# EAGLE design spinduino (EAGLE 8.2.2)
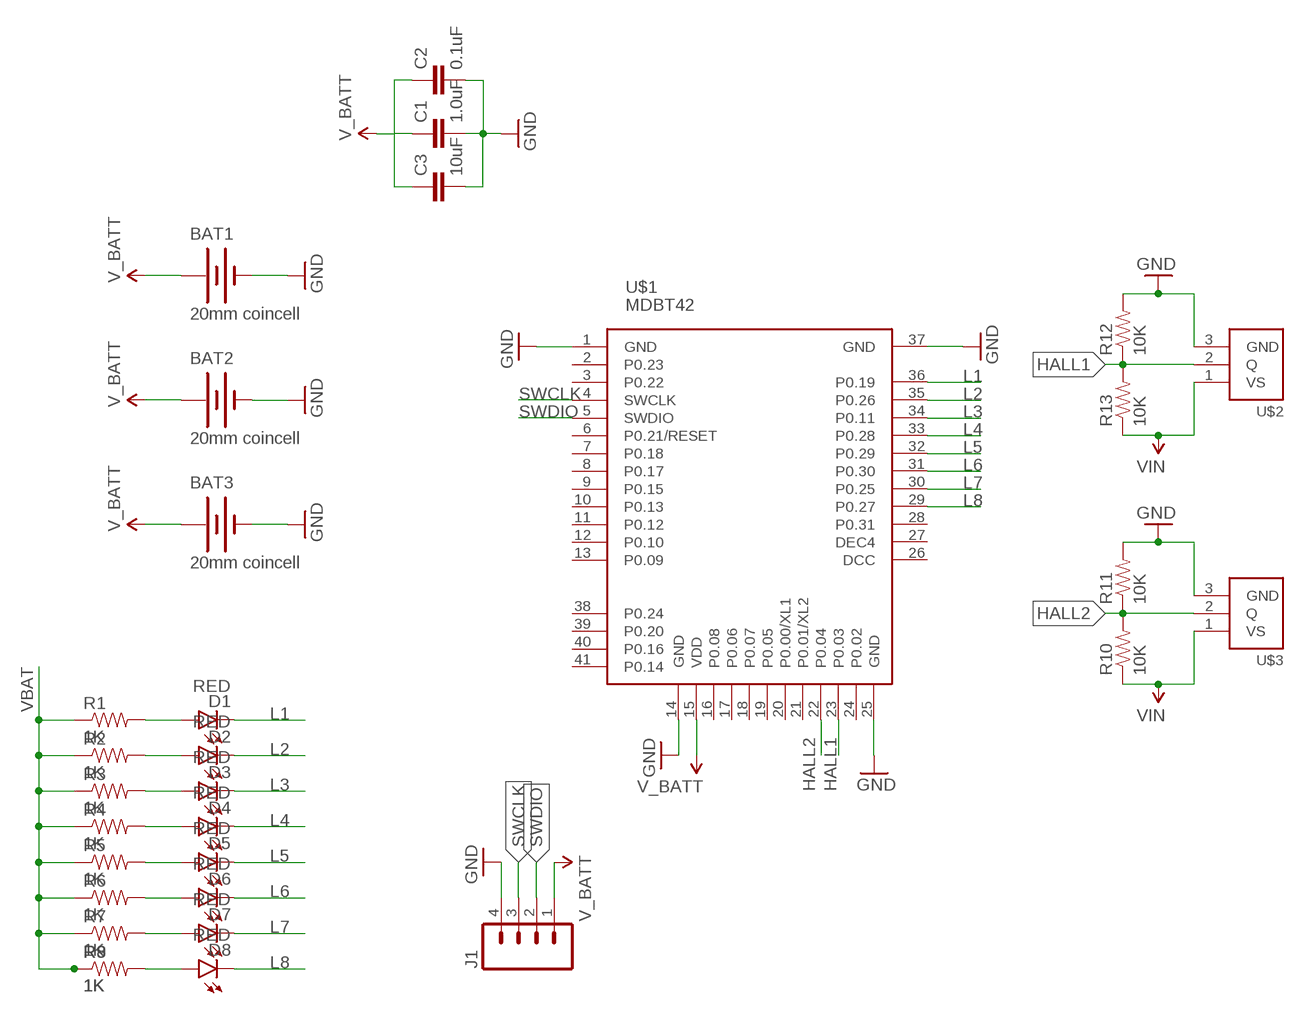
[diagram p0: schematic, sheet 1]

## Parts
BAT1  20mm coincell  BATTERY20MM_4LEGS  [BATTCON_20MM_4LEGS]
BAT2  20mm coincell  BATTERY20MM_4LEGS  [BATTCON_20MM_4LEGS]
BAT3  20mm coincell  BATTERY20MM_4LEGS  [BATTCON_20MM_4LEGS]
C1  1.0uF  1.0UF-16V-10%(0603)  [0603-CAP]
C2  0.1uF  0.1UF-25V-5%(0603)  [0603-CAP]
C3  10uF  10UF-6.3V-20%(0603)  [0603-CAP]
D1  RED  LED-RED0603  [LED-0603]
D2  RED  LED-RED0603  [LED-0603]
D3  RED  LED-RED0603  [LED-0603]
D4  RED  LED-RED0603  [LED-0603]
D5  RED  LED-RED0603  [LED-0603]
D6  RED  LED-RED0603  [LED-0603]
D7  RED  LED-RED0603  [LED-0603]
D8  RED  LED-RED0603  [LED-0603]
J1  M04LOCK  [1X04_LOCK]
R1  1K  1KOHM-1/10W-1%(0603)  [0603-RES]
R2  1K  1KOHM-1/10W-1%(0603)  [0603-RES]
R3  1K  1KOHM-1/10W-1%(0603)  [0603-RES]
R4  1K  1KOHM-1/10W-1%(0603)  [0603-RES]
R5  1K  1KOHM-1/10W-1%(0603)  [0603-RES]
R6  1K  1KOHM-1/10W-1%(0603)  [0603-RES]
R7  1K  1KOHM-1/10W-1%(0603)  [0603-RES]
R8  1K  1KOHM-1/10W-1%(0603)  [0603-RES]
R9  1K  1KOHM-1/10W-1%(0603)  [0603-RES]
R10  10K  10KOHM-1/10W-1%(0603)0603  [0603-RES]
R11  10K  10KOHM-1/10W-1%(0603)0603  [0603-RES]
R12  10K  10KOHM-1/10W-1%(0603)0603  [0603-RES]
R13  10K  10KOHM-1/10W-1%(0603)0603  [0603-RES]
U$1  MDBT42  [MDBT42]
U$2  TLE4946-2KSMD  [SC-59]
U$3  TLE4946-2KSMD  [SC-59]

## Nets
GND: BAT1.NEGATIVE(-) BAT2.NEGATIVE(-) BAT3.NEGATIVE(-) C1.2 C2.2 C3.2 J1.4 R11.2 R12.2 U$1.1(GND) U$1.14(GND) U$1.25(GND) U$1.37(GND) U$2.3(GND) U$3.3(GND)
HALL1: R12.1 R13.2 U$1.23(P0.03) U$2.2(Q)
HALL2: R10.2 R11.1 U$1.22(P0.04) U$3.2(Q)
L1: D1.C U$1.36(P0.19)
L2: D2.C U$1.35(P0.26)
L3: D3.C U$1.34(P0.11)
L4: D4.C U$1.33(P0.28)
L5: D5.C U$1.32(P0.29)
L6: D6.C U$1.31(P0.30)
L7: D7.C U$1.30(P0.25)
L8: D8.C U$1.29(P0.27)
N$1: D8.A R8.2 R9.2
N$3: D1.A R1.2
N$4: D2.A R2.2
N$5: D3.A R3.2
N$6: D4.A R4.2
N$7: D5.A R5.2
N$8: D6.A R6.2
N$9: D7.A R7.2
SWCLK: J1.3 U$1.4(SWCLK)
SWDIO: J1.2 U$1.5(SWDIO)
V_BATT: BAT1.POSITIVE@1(+) BAT1.POSITIVE@2(+) BAT1.POSITIVE@3(+) BAT1.POSITIVE@4(+) BAT2.POSITIVE@1(+) BAT2.POSITIVE@2(+) BAT2.POSITIVE@3(+) BAT2.POSITIVE@4(+) BAT3.POSITIVE@1(+) BAT3.POSITIVE@2(+) BAT3.POSITIVE@3(+) BAT3.POSITIVE@4(+) C1.1 C2.1 C3.1 J1.1 U$1.15(VDD)
VBAT: R1.1 R2.1 R3.1 R4.1 R5.1 R6.1 R7.1 R8.1 R9.1 R10.1 R13.1 U$2.1(VS) U$3.1(VS) ; supply symbol labelled VIN
Unconnected: U$1.2(P0.23) U$1.3(P0.22) U$1.6(P0.21/RESET) U$1.7(P0.18) U$1.8(P0.17) U$1.9(P0.15) U$1.10(P0.13) U$1.11(P0.12) U$1.12(P0.10) U$1.13(P0.09) U$1.16(P0.08) U$1.17(P0.06) U$1.18(P0.07) U$1.19(P0.05) U$1.20(P0.00/XL1) U$1.21(P0.01/XL2) U$1.24(P0.02) U$1.26(DCC) U$1.27(DEC4) U$1.28(P0.31) U$1.38(P0.24) U$1.39(P0.20) U$1.40(P0.16) U$1.41(P0.14)

## Library data of the parts
BAT1-BAT3 = ng-beacon:BATTERY: Battery Holders Various common sizes : AA, AAA, 18650 (PRT-12895), 20mm coin cell and 12mm coin cell. 20MM_4LEGS, BATT-10373; PROD_ID: BATT-10373
C1 = SparkFun-Capacitors:1.0UF-16V-10%(0603): CAP-00868; PROD_ID: CAP-00868
C2 = SparkFun-Capacitors:0.1UF-25V-5%(0603): CAP-08604; PROD_ID: CAP-08604
C3 = SparkFun-Capacitors:10UF-6.3V-20%(0603): CAP-11015; PROD_ID: CAP-11015
D1-D8 = SparkFun-LED:LED-RED: Assorted Red LEDs LilyPad 1206- DIO-09912 1206- DIO-00809 0603- DIO-00819 "SMART" means more efficient and expensive; PROD_ID: DIO-00819
J1 = ng-beacon:M04: Header 4 Standard 4-pin 0.1" header. Use with straight break away headers (SKU : PRT-00116), right angle break away headers (PRT-00553), swiss pins (PRT-00743), machine pins (PRT-00117), and female headers (PRT-00115). Molex polarized connector foot print use with SKU : PRT-08231 with associated crimp pins and housings. 1MM SMD Version SKU: PRT-10208; PROD_ID: CONN-09696
R1-R9 = SparkFun-Resistors:1KOHM-1/10W-1%(0603): RES-07856; PROD_ID: RES-07856
R10-R13 = SparkFun-Resistors:10KOHM-1/10W-1%(0603): RES-00824; PROD_ID: RES-00824
U$1 = MDBT42:MDBT42: Raytac Corporation MDBT42-512K, MDBT42-P512K Bluetooth Low Energy Module based on Noridc nRF52832 Source: Raytac datasheet
U$2 U$3 = uri:TLE4946-2K: TLE4946-2K High Precision Hall Effect Latch Datasheet <https://www.infineon.com/dgdl/Infineon-TLE4946_2K-DS-v01_00-en.pdf?fileId=db3a30431f848401011fbc925c48637f>

## Board
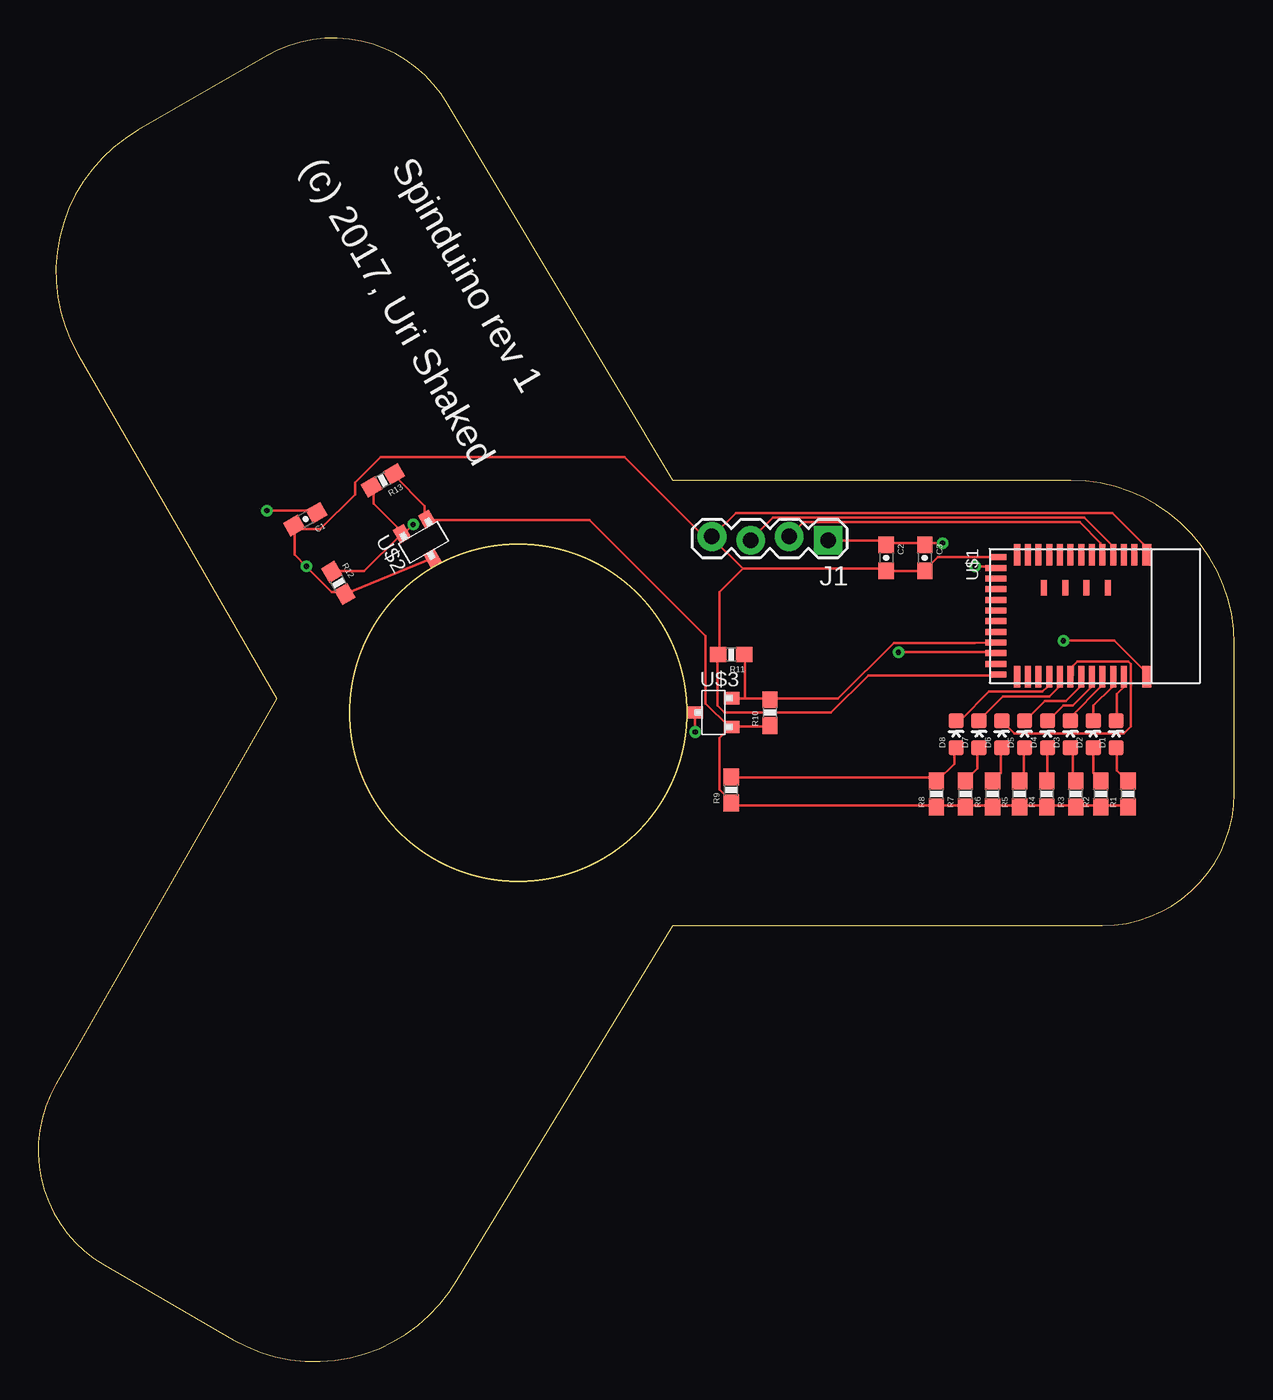
[diagram p1: board, top side]
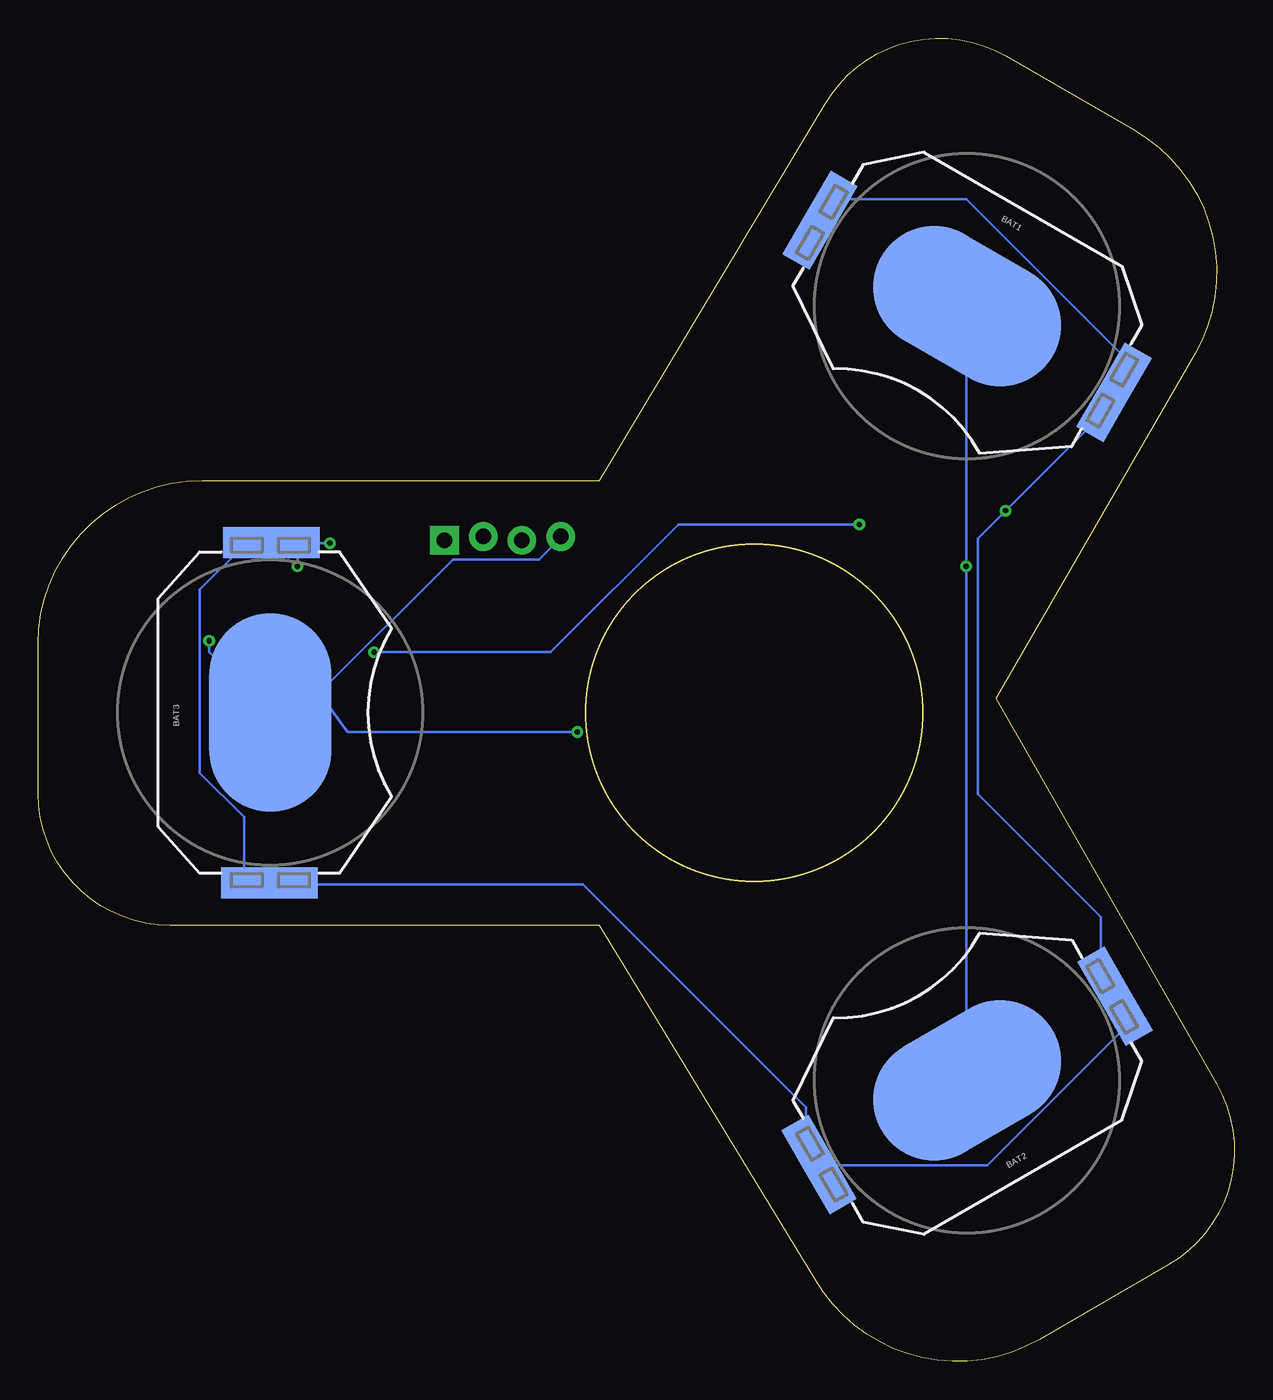
[diagram p2: board, bottom side, seen from below]

Size 78.51 x 86.84 mm. Coordinates in mm from the lower left corner, seen from the top.
Outline: 41.68,28.6 69.84,28.6 arc90 78.51,37.28 78.51,47.06 arc90 67.76,57.81 41.68,57.81 26.86,82.51 arc90 15.01,85.68 6.54,80.79 arc90 2.6,66.1 15.64,43.52 1.16,18.18 arc90 4.33,6.33 12.81,1.44 arc90 27.49,5.37 41.68,28.6
Outline: circle at 31.52,42.57 radius 11.05
Copper layers (1*16): Top 0.035mm / dielectric 1.5mm / Bottom 0.035mm
Design rules "default": minimum track width 6mil, minimum drill 0.35mm, track to track 6mil, track to pad 6mil, pad to pad 6mil, via to via 6mil, smd to smd 6mil, copper to edge 40mil, drill to drill 6mil, minimum pad ring 10mil, minimum via ring 8mil, stop-mask expansion 4mil, vias tented up to drill 0mil, thermal gap 10mil

### Footprints (pad centres in the part's own frame; a part is rotated, then mirrored left to right if it is on the bottom)
BATTCON_20MM_4LEGS = smd 13 x 8: NEGATIVE 0,0 | smd 2.032 x 3.175: POSITIVE@1 -11.176,1.651; POSITIVE@2 -11.176,-1.524; POSITIVE@3 11.176,1.524; POSITIVE@4 11.176,-1.651
0603-CAP = smd 1.1 x 1: 1 -0.85,0; 2 0.85,0
LED-0603 = smd 1 x 1: A 0,-0.877; C 0,0.877
1X04_LOCK = drill 1.016 pad 1.88 square: 1 0,0.127 | drill 1.016 pad 1.88: 2 2.54,-0.127; 3 5.08,0.127; 4 7.62,-0.127
0603-RES = smd 1.1 x 1: 1 -0.85,0; 2 0.85,0
MDBT42 = smd 1.4 x 0.6: 1 -4,4.4; 37 4,4.4 | smd 1.4 x 0.4: 2 -4,3.6; 3 -4,2.9; 4 -4,2.2; 5 -4,1.5; 6 -4,0.8; 7 -4,0.1; 8 -4,-0.6; 9 -4,-1.3; 10 -4,-2; 11 -4,-2.7; 12 -4,-3.4; 13 -4,-4.1; 26 4,-4.1; 27 4,-3.4; 28 4,-2.7; 29 4,-2; 30 4,-1.3; 31 4,-0.6; 32 4,0.1; 33 4,0.8; 34 4,1.5; 35 4,2.2; 36 4,2.9 | smd 0.4 x 1.1: 14 -3.85,-5.35; 25 3.85,-5.35 | smd 0.4 x 1.4: 15 -3.15,-5.5; 16 -2.45,-5.5; 17 -1.75,-5.5; 18 -1.05,-5.5; 19 -0.35,-5.5; 20 0.35,-5.5; 21 1.05,-5.5; 22 1.75,-5.5; 23 2.45,-5.5; 24 3.15,-5.5 | smd 1 x 0.4: 38 -1.85,1.85; 39 -1.85,0.45; 40 -1.85,-0.95; 41 -1.85,-2.35
SC-59 = smd 0.8 x 1: 1 -0.95,-1.2; 2 0.95,-1.2; 3 0,1.2

### Placement (x,y rotation side)
BAT1  17.55,69.24 330 bottom
BAT2  17.55,18.44 210 bottom
BAT3  63.27,42.57 90 bottom
C1  17.55,55.27 210 top
C2  55.65,52.73 270 top
C3  58.19,52.73 270 top
D1  70.74,41.16 0 top
D2  69.24,41.16 0 top
D3  67.74,41.16 0 top
D4  66.24,41.16 0 top
D5  64.74,41.16 0 top
D6  63.24,41.16 0 top
D7  61.74,41.16 0 top
D8  60.24,41.16 0 top
J1  51.84,54 180 top
R1  71.52,37.24 90 top
R2  69.75,37.24 90 top
R3  68.09,37.24 90 top
R4  66.19,37.24 90 top
R5  64.41,37.24 90 top
R6  62.63,37.24 90 top
R7  60.86,37.24 90 top
R8  58.95,37.24 90 top
R9  45.49,37.49 90 top
R10  48.03,42.57 90 top
R11  45.49,46.38 180 top
R12  19.71,51.08 300 top
R13  22.63,57.81 210 top
U$1  68.35,48.92 270 top
U$2  25.3,53.75 210 top
U$3  44.32,42.57 90 top

### Tracks (layer width: path | path; a pad name or v marks a point on that pad's centre or on a via)
GND  (via drill 0.35)
  Top 0.152: U$2.3 R12.2 20.04,50.5 19.28,50.5 v17.6,52.17 16.84,52.94 16.84,54.61 | v67.28,47.3 70.63,47.3 72.62,45.32 72.62,45.01 U$1.37 | U$1.25 62.86,45.01 54.48,45.01 52.04,42.57 45.03,42.57 44.57,43.03 44.57,46.38 R11.2 44.73,46.38 44.73,50.5 46.25,52.02 | 16.84,54.61 16.84,54.77 C1.2 16.84,54.61 | U$1.14 62.86,52.78 59.05,52.78 58.29,52.02 C3.2 58.14,51.87 55.7,51.87 C2.2 55.55,52.02 46.25,52.02 | U$1.1 72.62,52.94 72.62,53.55 70.48,55.68 45.79,55.68 44.27,54.16 J1.4 | 46.25,52.02 44.27,54 J1.4 | 16.84,54.61 18.51,54.61 20.8,56.9 20.8,57.66 22.48,59.34 38.48,59.34 43.66,54.16 44.12,54.16 J1.4 | U$3.3 v43.12,41.3
  Bottom 0.152: v67.28,47.3 67.28,46.54 63.32,42.57 BAT3.NEGATIVE 61.34,42.57 60.06,43.85 | 60.06,43.85 51.28,52.63 45.64,52.63 44.27,54 J1.4 | BAT2.NEGATIVE 17.6,18.49 v17.6,52.17 17.6,69.24 BAT1.NEGATIVE | v43.12,41.3 58.19,41.3 60.06,43.85
HALL1  (via drill 0.35)
  Top 0.152: R12.1 19.43,51.87 21.41,51.87 23.85,54.31 U$2.2 | R13.2 22.02,57.36 22.02,56.29 23.85,54.46 U$2.2 | v56.46,46.54 62.71,46.54 U$1.23 | v24.61,54.92 24,54.31 U$2.2
  Bottom 0.152: v56.46,46.54 44.88,46.54 36.5,54.92 v24.61,54.92
HALL2
  Top 0.152: 46.4,43.49 47.93,43.49 R10.2 48.08,43.49 52.5,43.49 56.16,47.15 61.49,47.15 U$1.22 | 46.4,43.49 45.49,43.49 U$3.2 | 46.4,43.49 46.4,46.38 R11.1
L1
  Top 0.152: D1.C 70.79,42.12 70.79,43.79 71.24,44.25 71.24,44.86 U$1.36
L2
  Top 0.152: D2.C 69.26,42.12 69.26,43.03 70.48,44.25 70.48,44.86 U$1.35
L3
  Top 0.152: D3.C 67.89,42.12 67.89,42.42 69.72,44.25 69.72,44.86 U$1.34
L4
  Top 0.152: D4.C 66.37,42.12 67.28,43.03 67.89,43.03 69.11,44.25 69.11,44.86 U$1.33
L5
  Top 0.152: D5.C 64.84,42.12 66.06,43.34 67.43,43.34 68.35,44.25 68.35,44.86 U$1.32
L6
  Top 0.152: D6.C 63.32,41.96 64.08,41.2 71.24,41.2 71.7,41.66 71.7,45.77 71.55,45.93 68.2,45.93 67.89,45.62 67.89,45.01 U$1.31
L7
  Top 0.152: D7.C 61.8,42.12 63.32,43.64 66.37,43.64 66.98,44.25 66.98,44.86 U$1.30
L8
  Top 0.152: D8.C 60.27,42.12 60.58,42.12 62.4,43.95 65.91,43.95 66.21,44.25 66.21,44.86 U$1.29
N$1
  Top 0.152: R9.2 45.49,38.31 58.75,38.31 58.9,38.15 R8.2 59.05,38.15 60.12,39.22 60.12,40.14 D8.A
N$3
  Top 0.152: D1.A 70.79,40.14 70.79,38.76 71.4,38.15 R1.2
N$4
  Top 0.152: D2.A 69.26,40.14 69.26,38.61 69.72,38.15 R2.2
N$5
  Top 0.152: D3.A 67.89,40.14 67.89,38.31 68.04,38.15 R3.2
N$6
  Top 0.152: D4.A 66.21,40.14 66.21,38.15 R4.2
N$7
  Top 0.152: D5.A 64.69,40.14 64.69,38.31 64.54,38.15 R5.2
N$8
  Top 0.152: D6.A 63.17,40.14 63.17,38.61 62.71,38.15 R6.2
N$9
  Top 0.152: D7.A 61.64,40.14 61.64,38.92 60.88,38.15 R7.2
SWCLK
  Top 0.152: U$1.4 70.48,52.94 70.48,53.55 68.65,55.38 48.23,55.38 46.86,54 J1.3
SWDIO
  Top 0.152: U$1.5 69.72,52.94 69.72,53.7 68.35,55.07 50.21,55.07 49.3,54.16 J1.2
V_BATT  (via drill 0.35)
  Top 0.152: v61.49,52.17 62.71,52.17 U$1.15 | v59.36,53.7 58.29,53.7 C3.1 58.14,53.7 55.7,53.7 C2.1 | 55.39,53.85 55.55,53.7 C2.1 | v15.01,55.83 18.21,55.83 C1.1 | 55.39,53.85 51.89,53.85 J1.1 | 55.39,53.85 C2.1
  Bottom 0.152: 26.59,12.86 26.59,11.64 BAT2.POSITIVE@3 26.59,12.86 | 26.59,12.86 27.96,14.23 BAT2.POSITIVE@4 28.11,14.38 28.11,16.67 42.75,31.3 61.64,31.3 BAT3.POSITIVE@2 BAT3.POSITIVE@1 65,31.45 65,35.72 67.89,38.61 67.89,50.65 BAT3.POSITIVE@3 64.69,53.85 61.64,53.85 BAT3.POSITIVE@4 61.49,53.7 | 26.59,12.86 16.23,12.86 7.08,22 7.08,22.46 BAT2.POSITIVE@1 7.08,22.61 7.08,23.68 8.61,25.2 BAT2.POSITIVE@2 8.76,25.35 8.76,29.16 16.84,37.24 16.84,54 v15.01,55.83 8.76,62.08 BAT1.POSITIVE@4 8.61,62.23 7.24,63.6 7.24,64.82 BAT1.POSITIVE@3 7.24,64.98 7.24,65.89 17.6,76.25 26.29,76.25 BAT1.POSITIVE@1 26.44,76.25 27.96,74.73 27.96,73.66 BAT1.POSITIVE@2 | 61.49,53.7 v61.49,52.17 | v59.36,53.7 61.49,53.7
VBAT
  Top 0.152: R1.1 71.4,36.48 69.87,36.48 R2.1 69.72,36.48 68.2,36.48 R3.1 68.04,36.48 66.21,36.48 R4.1 66.06,36.48 64.54,36.48 R5.1 64.39,36.48 62.71,36.48 R6.1 62.56,36.48 60.88,36.48 R7.1 60.73,36.48 59.05,36.48 R8.1 58.9,36.48 45.64,36.48 45.49,36.63 R9.1 45.49,36.78 44.73,37.54 44.73,40.9 45.34,41.51 U$3.1 | R13.1 23.39,58.12 25.37,56.14 25.37,55.38 U$2.1 25.52,55.22 36.19,55.22 43.81,47.6 43.81,43.18 45.34,41.66 U$3.1 | U$3.1 45.49,41.66 47.93,41.66 R10.1

### Text on the board
tNames: Spinduino rev 1 | (c) 2017, Uri Shaked